# EAGLE design NanoTrac (EAGLE 7.2.0)
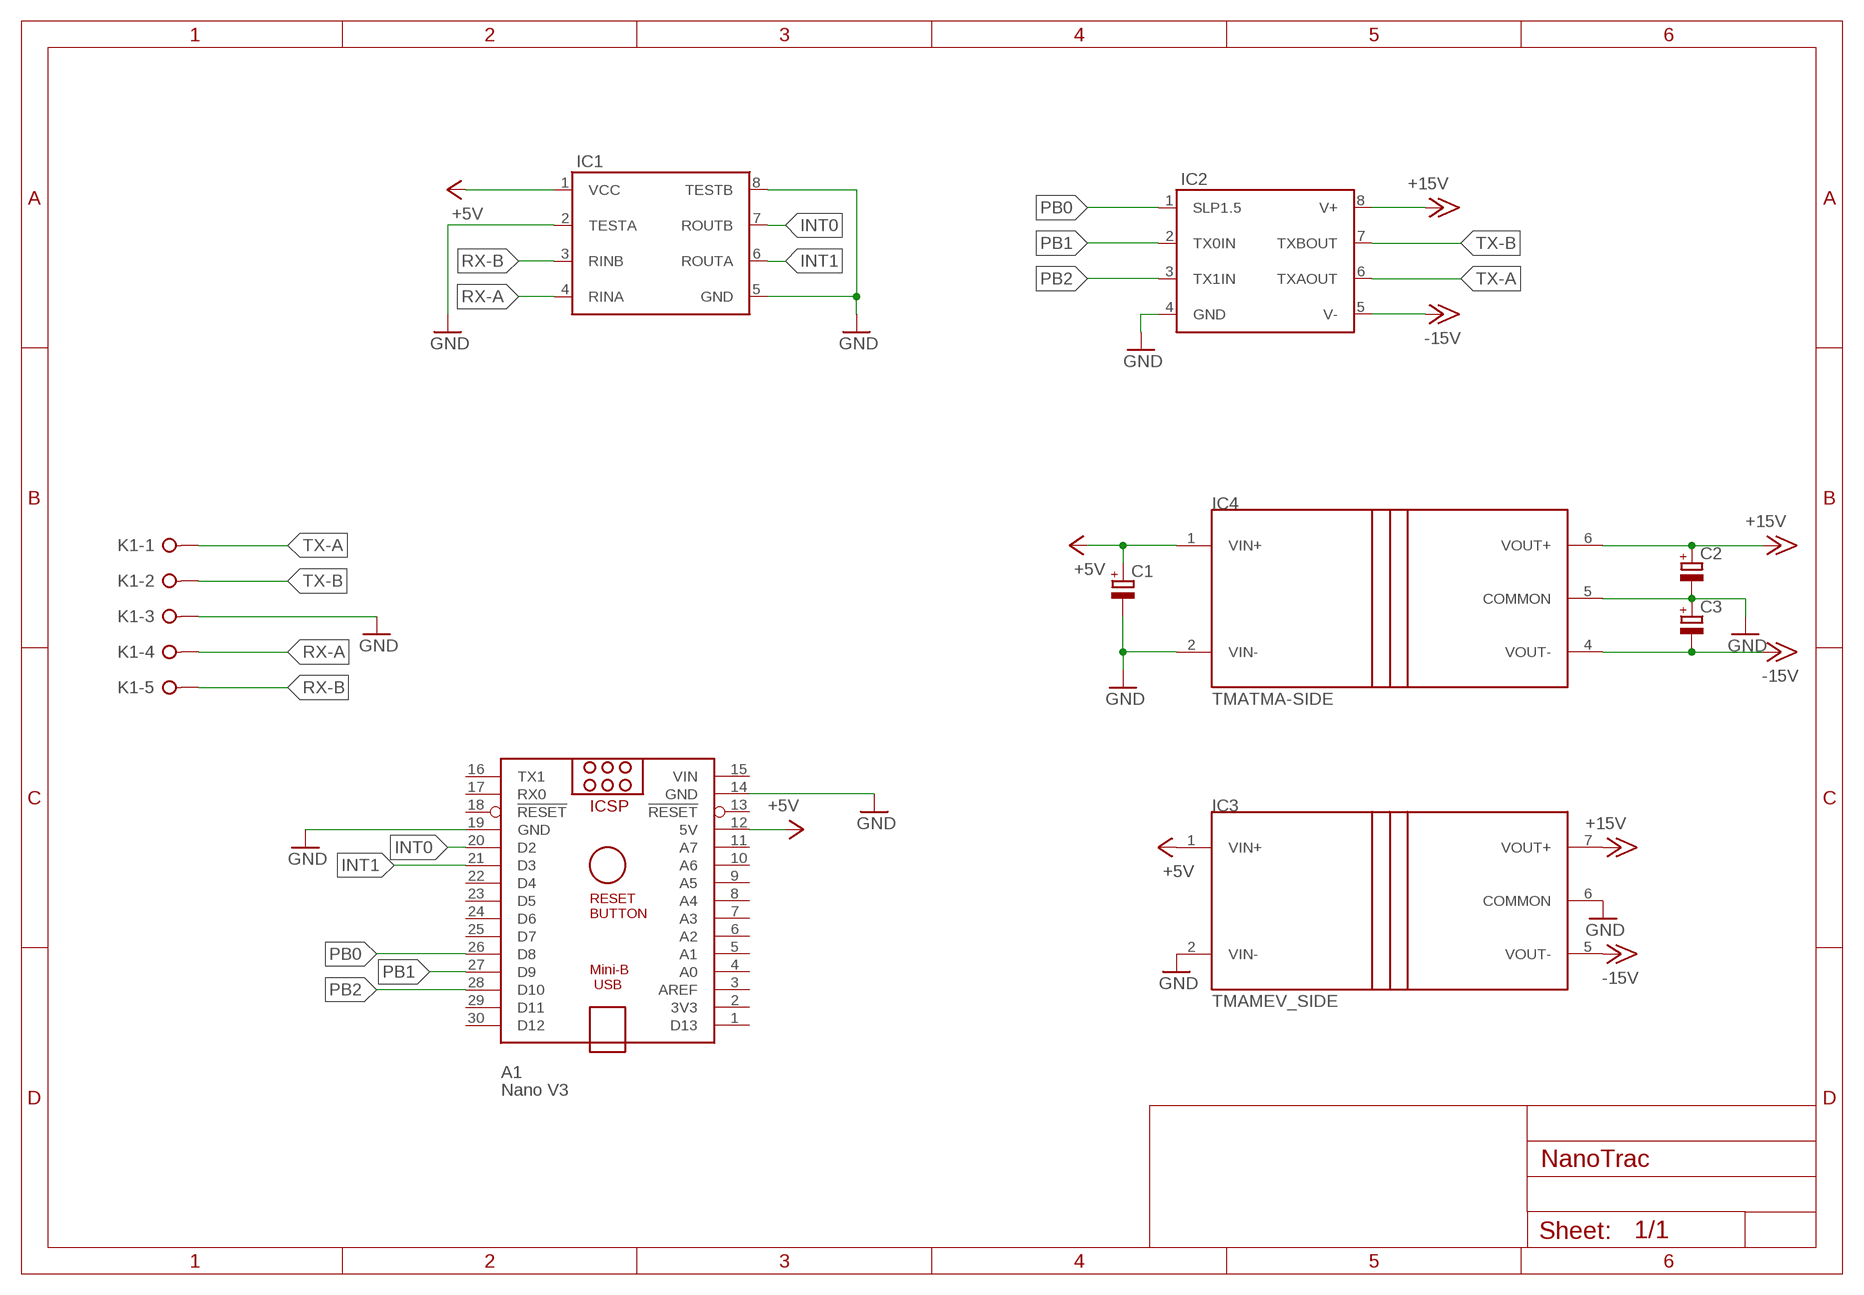
[diagram p0: schematic, sheet 1]

## Parts
A1  Nano V3  ARDUINO_NANO  [ARDUINO_NANO]
C1  CPOL-EUE2-4  [E2-4]
C2  CPOL-EUE2-4  [E2-4]
C3  CPOL-EUE2-4  [E2-4]
IC1  HI-8588HN  [SOIC8]
IC2  HI-8586HN  [SOIC8]
IC3  TMAMEV_SIDE  [MEV_SIP7_SIDE]
IC4  TMATMA-SIDE  [SIP7_SIDE]
K1  W237-05P  [W237-5P]

## Nets
+5V: A1.12(5V) C1.+ IC1.1(VCC) IC3.1(VIN+) IC4.1(VIN+)
+15V: C2.+ IC2.8(V+) IC3.7(VOUT+) IC4.6(VOUT+)
-15V: C3.- IC2.5(V-) IC3.5(VOUT-) IC4.4(VOUT-)
GND: A1.14(GND) A1.19(GND) C1.- C2.- C3.+ IC1.2(TESTA) IC1.5(GND) IC1.8(TESTB) IC2.4(GND) IC3.2(VIN-) IC3.6(COMMON) IC4.2(VIN-) IC4.5(COMMON) K1.3
INT0: A1.20(D2) IC1.7(ROUTB)
INT1: A1.21(D3) IC1.6(ROUTA)
PB0: A1.26(D8) IC2.1(SLP1.5)
PB1: A1.27(D9) IC2.2(TX0IN)
PB2: A1.28(D10) IC2.3(TX1IN)
RX-A: IC1.4(RINA) K1.4
RX-B: IC1.3(RINB) K1.5
TX-A: IC2.6(TXAOUT) K1.1
TX-B: IC2.7(TXBOUT) K1.2
Unconnected: A1.1(D13) A1.2(3V3) A1.3(AREF) A1.4(A0) A1.5(A1) A1.6(A2) A1.7(A3) A1.8(A4) A1.9(A5) A1.10(A6) A1.11(A7) A1.13(!RESET) A1.16(TX1) A1.17(RX0) A1.18(!RESET) A1.22(D4) A1.23(D5) A1.24(D6) A1.25(D7) A1.29(D11) A1.30(D12)

## Power pins joined to a net without a drawn wire
VIN: A1.15(VIN)

## Library data of the parts
A1 = ArduinoNanoV30:ARDUINO_NANO: Arduino Nano V3.0 Overview: The Arduino Nano is a small, complete, and breadboard-friendly board based on the ATmega328 (Arduino Nano 3.x) or ATmega168 (Arduino Nano 2.x). It has more or less the same functionality of the Arduino Duemilanove, but in a different package. It lacks only a DC power jack, and works with a Mini-B USB cable instead of a standard one. The Nano was designed and is being produced by Gravitech. Specifications: Microcontroller Atmel ATmega168 or ATmega328 Operating Voltage (logic level) 5 V Input Voltage (recommended) 7-12 V Input Voltage (limits) 6-20 V Digital I/O Pins 14 (of which 6 provide PWM output) Analog Input Pins 8 DC Current per I/O Pin 40 mA Flash Memory 16 KB (ATmega168) or 32 KB (ATmega328) of which 2 KB used by bootloader SRAM 1 KB (ATmega168) or 2 KB (ATmega328) EEPROM 512 bytes (ATmega168) or 1 KB (ATmega328) Clock Speed 16 MHz Dimensions 0.73" x 1.70" Length 45 mm Width 18 mm Weigth 5 g Power: The Arduino Nano can be powered via the Mini-B USB connection, 6-20V unregulated external power supply (pin 30), or 5V regulated external power supply (pin 27). The power source is automatically selected to the highest voltage source. Memory: The ATmega168 has 16 KB of flash memory for storing code (of which 2 KB is used for the bootloader); the ATmega328 has 32 KB, (also with 2 KB used for the bootloader). The ATmega168 has 1 KB of SRAM and 512 bytes of EEPROM (which can be read and written with the EEPROM library); the ATmega328 has 2 KB of SRAM and 1 KB of EEPROM. Input and Output: Each of the 14 digital pins on the Nano can be used as an input or output, using pinMode(), digitalWrite(), and digitalRead() functions. They operate at 5 volts. Each pin can provide or receive a maximum of 40 mA and has an internal pull-up resistor (disconnected by default) of 20-50 kOhms. In addition, some pins have specialized functions. Visit Arduino - ArduinoBoardNano <https://www.arduino.cc/en/Main/ArduinoBoardNano>
C1-C3 = rcl:CPOL-EU: POLARIZED CAPACITOR, European symbol
IC1 = HOLT:HI-8588: Dual In Line / Socket
IC2 = HOLT:HI-8586
IC3 IC4 = traco_tma:TMA: Traco Power TMA Series DC/DC Converter
K1 = con-wago-508:W237-05P: WAGO SREW CLAMP; OC_FARNELL: unknown; OC_NEWARK: unknown

## Board
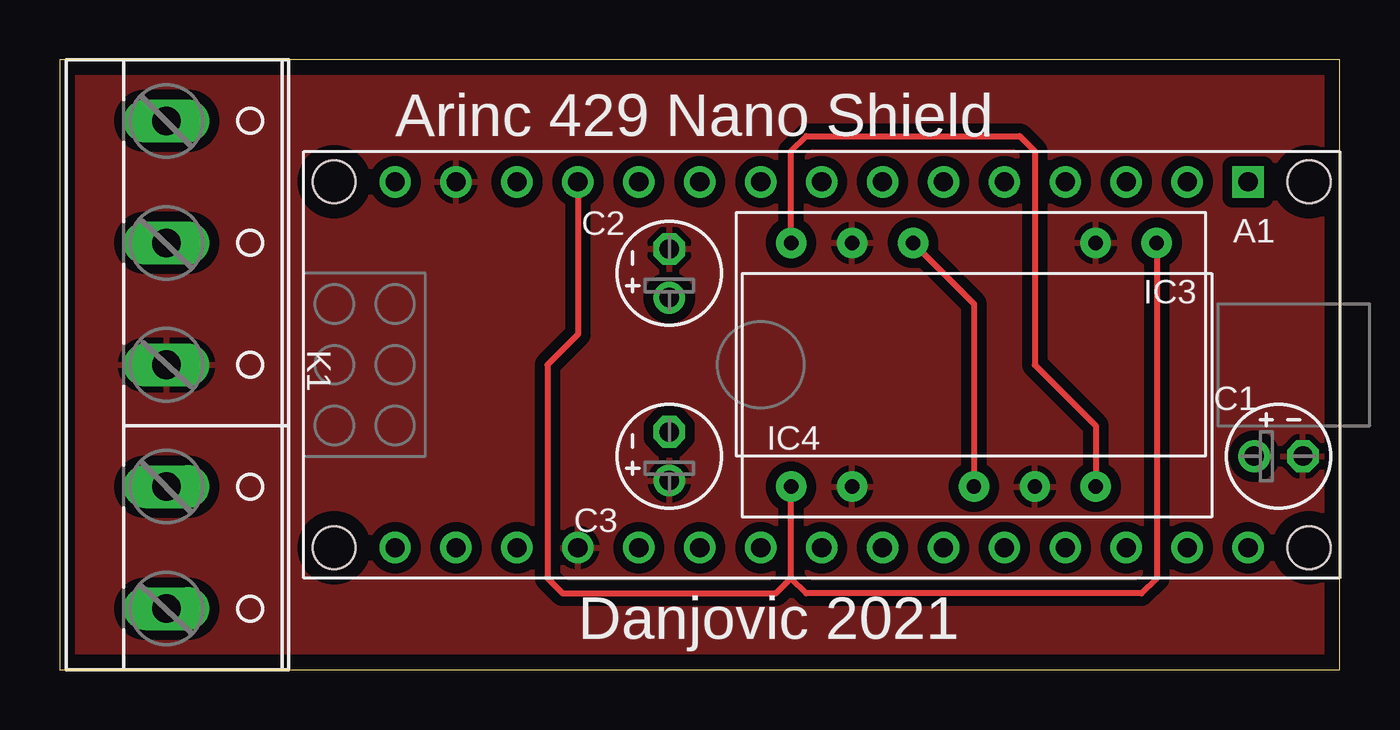
[diagram p1: board, top side]
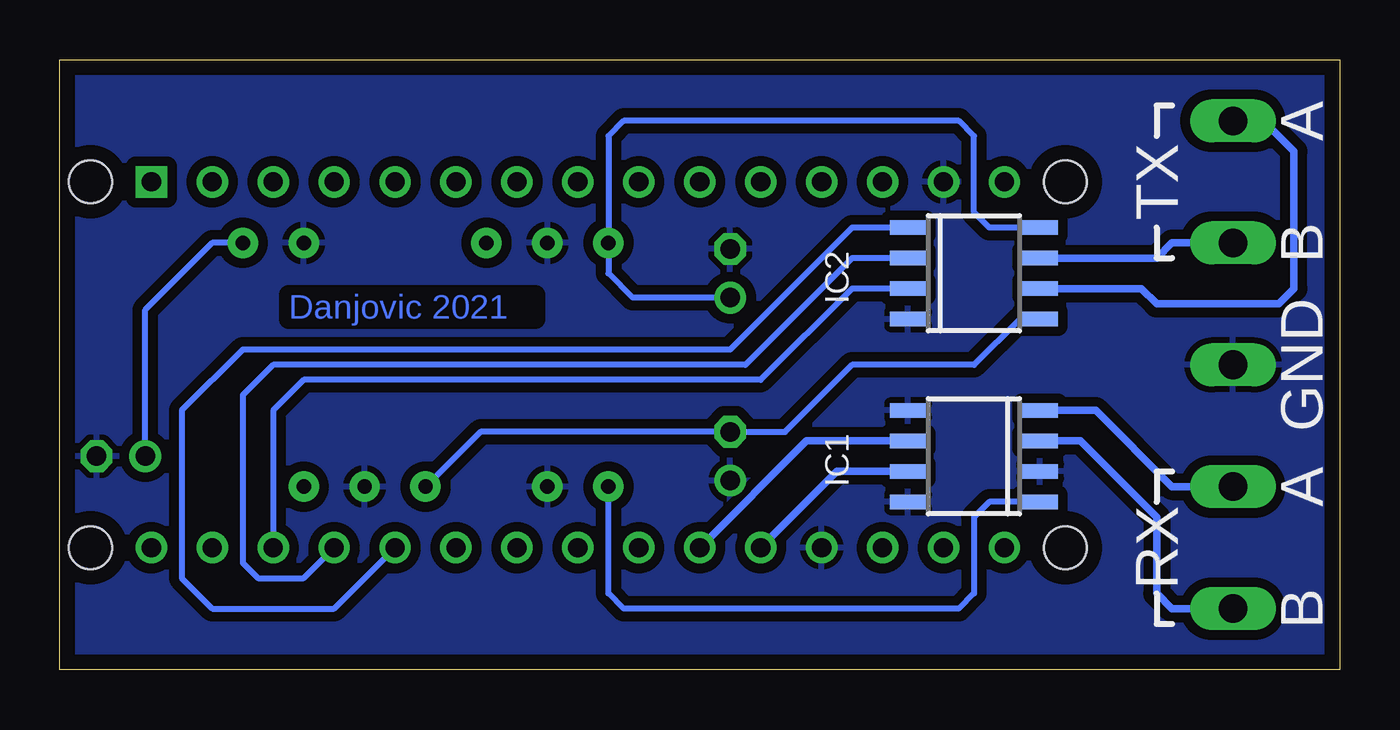
[diagram p2: board, bottom side, seen from below]

Size 53.34 x 25.4 mm. Coordinates in mm from the lower left corner, seen from the top.
Outline: 0,0 53.34,0 53.34,25.4 0,25.4 0,0
Copper layers (1*16): Top 0.035mm / dielectric 1.5mm / Bottom 0.035mm
Design rules "default *": minimum track width 10mil, minimum drill 24mil, track to track 8mil, track to pad 8mil, pad to pad 8mil, via to via 8mil, smd to smd 8mil, copper to edge 25mil, drill to drill 8mil, minimum pad ring 10mil, minimum via ring 8mil, stop-mask expansion 4mil, vias tented up to drill 0mil, thermal gap 10mil

### Footprints (pad centres in the part's own frame; a part is rotated, then mirrored left to right if it is on the bottom)
ARDUINO_NANO = drill 0.8 square: 1 -20.32,-7.62 | drill 0.8: 2 -17.78,-7.62; 3 -15.24,-7.62; 4 -12.7,-7.62; 5 -10.16,-7.62; 6 -7.62,-7.62; 7 -5.08,-7.62; 8 -2.54,-7.62; 9 0,-7.62; 10 2.54,-7.62; 11 5.08,-7.62; 12 7.62,-7.62; 13 10.16,-7.62; 14 12.7,-7.62; 15 15.24,-7.62; 16 15.24,7.62; 17 12.7,7.62; 18 10.16,7.62; 19 7.62,7.62; 20 5.08,7.62; 21 2.54,7.62; 22 0,7.62; 23 -2.54,7.62; 24 -5.08,7.62; 25 -7.62,7.62; 26 -10.16,7.62; 27 -12.7,7.62; 28 -15.24,7.62; 29 -17.78,7.62; 30 -20.32,7.62 | hole 1.778: -22.86,-7.62; -22.86,7.62; 17.78,7.62; 17.78,-7.62
E2-4 = drill 0.813 pad 1.27: + -1.016,0 | drill 0.813 pad 1.27 octagon: - 1.016,0
SOIC8 = smd 0.6 x 1.5: 1 -1.905,-2.75; 2 -0.635,-2.75; 3 0.635,-2.75; 4 1.905,-2.75; 5 1.905,2.75; 6 0.635,2.75; 7 -0.635,2.75; 8 -1.905,2.75
MEV_SIP7_SIDE = drill 0.6 pad 1.27: 1 -7.62,0; 2 -5.08,0; 5 2.54,0; 6 5.08,0; 7 7.62,0
SIP7_SIDE = drill 0.6 pad 1.27: 1 -5.08,0; 2 -2.54,0; 4 2.54,0; 5 5.08,0; 6 7.62,0
W237-5P = drill 1.194 long: 1 -10.16,-0.635; 2 -5.08,-0.635; 3 0,-0.635; 4 5.08,-0.635; 5 10.16,-0.635

### Placement (x,y rotation side)
A1  29.21,12.7 180 top
C1  50.8,8.89 0 top
C2  25.4,16.51 90 top
C3  25.4,8.89 90 top
IC1  15.24,8.89 90 bottom
IC2  15.24,16.51 270 bottom
IC3  38.1,17.78 180 top
IC4  35.56,7.62 0 top
K1  5.08,12.7 270 top

### Tracks (layer width: path | path; a pad name or v marks a point on that pad's centre or on a via)
+5V
  Top 0.254: IC3.1 45.72,3.81 45.09,3.17 31.11,3.17 30.48,3.81 | 30.48,3.81 IC4.1 | A1.12 21.59,13.97 20.32,12.7 20.32,3.81 20.95,3.17 29.84,3.17 30.48,3.81
  Bottom 0.254: IC1.1 14.61,6.98 15.24,6.35 15.24,3.17 15.88,2.54 29.84,2.54 30.48,3.17 IC4.1 | IC3.1 46.99,17.78 49.78,14.99 C1.+
+15V
  Top 0.254: IC3.7 30.48,21.59 31.11,22.22 40.01,22.22 40.64,21.59 40.64,12.7 43.18,10.16 IC4.6
  Bottom 0.254: IC2.8 14.61,18.41 15.24,19.05 15.24,22.22 15.88,22.86 29.84,22.86 30.48,22.22 IC3.7 30.48,16.51 29.46,15.49 C2.+
-15V
  Top 0.254: IC3.5 38.1,15.24 IC4.4
  Bottom 0.254: IC4.4 35.81,9.91 C3.- 23.11,9.91 20.32,12.7 15.24,12.7 13.34,14.6 IC2.5
GND
  pour Bottom (isolate 0.406): 0,0 53.34,0 53.34,25.4 0,25.4
  pour Top (isolate 0.406): 0,0 53.34,0 53.34,25.4 0,25.4
INT0
  Bottom 0.305: IC1.7 20.95,8.25 A1.20
INT1
  Bottom 0.305: IC1.6 22.23,9.52 A1.21
PB0
  Bottom 0.254: IC2.1 20.32,18.41 25.4,13.34 45.72,13.34 48.26,10.79 48.26,3.81 46.99,2.54 41.91,2.54 A1.26
PB1
  Bottom 0.254: IC2.2 20.32,17.14 24.77,12.7 44.45,12.7 45.72,11.43 45.72,4.45 45.09,3.81 43.18,3.81 A1.27
PB2
  Bottom 0.254: IC2.3 20.32,15.88 24.13,12.06 43.18,12.06 44.45,10.79 A1.28
RX-A
  Bottom 0.305: IC1.4 10.16,10.79 6.99,7.62 K1.4
RX-B
  Bottom 0.305: IC1.3 10.79,9.52 7.62,6.35 7.62,3.17 6.99,2.54 K1.5
TX-A
  Bottom 0.305: IC2.6 8.26,15.88 7.62,15.24 2.54,15.24 1.91,15.88 1.91,21.59 3.17,22.86 K1.1
TX-B
  Bottom 0.305: IC2.7 7.62,17.14 6.99,17.78 K1.2

### Text on the board
Bottom: Danjovic 2021
tPlace: Arinc 429 Nano Shield | Danjovic 2021
bPlace: A | TX | B | GND | A | RX | B